# Altium project IBB.PrjPcb (part 3 of 11)
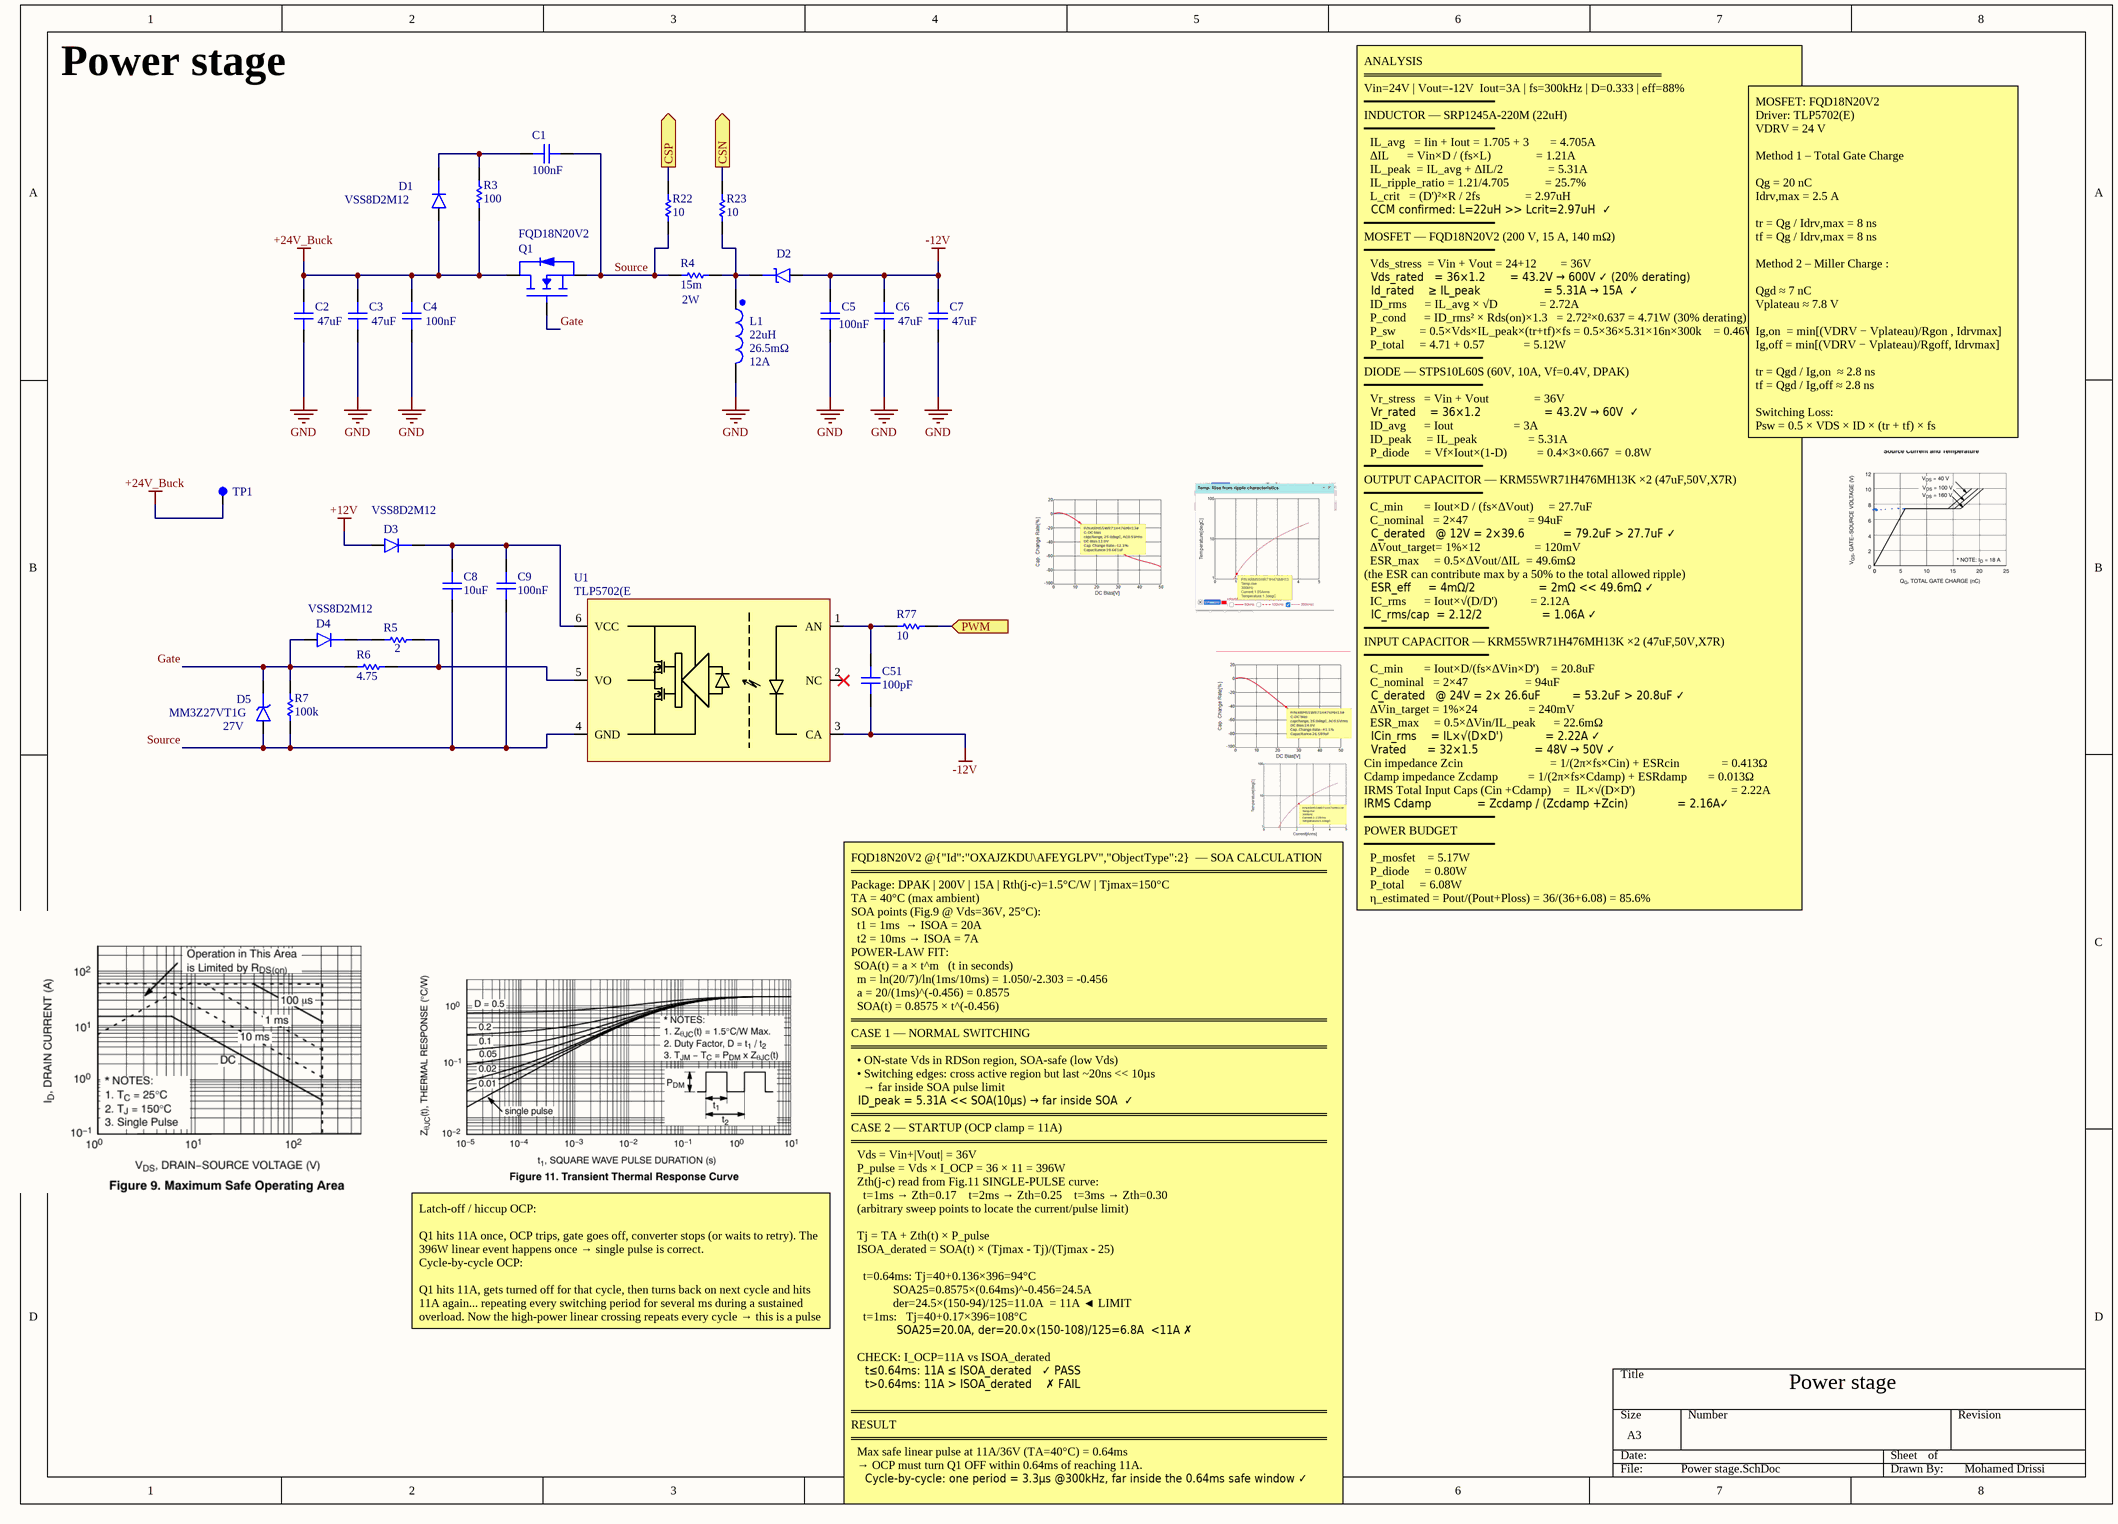
[diagram p9: Power stage.SchDoc]

## Sheet Power stage.SchDoc (continued)

### Library data of the parts (continued)
R22 R23 = Yageo RC0603FR-0710RL: Res Thick Film 0603 1K Ohm 1% 0.1W(1/10W) ±100ppm/°C Pad SMD T/R / RES SMD 1K OHM 1% 1/10W 0603; Manufacturer: Yageo Group; Manufacturer Part Number: RC0603FR-071KL; Power Rating: 100mW; Value: 1kΩ; Voltage Rating: 50V; Working Voltage: 75V; Supplier: DigiKey; Supplier Part Number: 311-1.00KHRDKR-ND; RoHS: Compliant; Category: Chip SMD Resistors; Stock: 2879129; Pricing: 1=0,1, 10=0,025, 25=0,0188, 50=0,015, 100=0,0122, 250=0,0094, 500=0,00782, 1000=0,00661 (USD); Case/Package: 0603; Case Code (Imperial): 0603; Case Code (Metric): 0603; China RoHS: Non-Compliant; Composition: Thick Film; Contact Plating: Tin; Country of Origin: Mainland China, Taiwan; Depth: 800µm; Export Control Classification Number (ECCN) Code: EAR99; Height: 450µm; Harmonized Tariff Schedule (HTS) Code: 8533.21.00.30; Introduction Date: 2004-10-04; Lead Free: Lead Free; Length: 1.6mm; Lifecycle Status: Production; Max Operating Temperature: 155°C; Military Standard: Not; Min Operating Temperature: -55°C; Mounting Technology: Surface Mount; Pins: 2; Number of Terminals: 2; Packaging: Tape and Reel; Radiation Hardening: No; REACH SVHC: Yes; Schedule B: 8533210045, 8533210045|8533210045|8533210045|8533210045|8533210045|8533210045|8533210045|8533210045|8533210045|8533210045|8533210045|8533210045|8533210045|8533210045|8533210045|8533210045|8533210045|8533210045|8533210045|8533210045|8533210045|8533210045|8533210045|85; Temperature Coefficient: 100ppm/°C; Termination: SMD/SMT; Tolerance: 1%; Voltage Rating (DC): 50V; Width: 800µm; ComponentLink1URL: https://datasheet.octopart.com:443/RC0603FR-071KL-Yageo-datasheet-175887523.pdf?src-supplier=Newark; ComponentLink1Description: https://datasheet.octopart.com:443/RC0603FR-071KL-Yageo-datasheet-175887523.pdf?src-supplier=Newark; ComponentLink2URL: https://datasheet.octopart.com:443/RC0603FR-071KL-Yageo-datasheet-34211833.pdf?src-supplier=Newark; ComponentLink2Description: https://datasheet.octopart.com:443/RC0603FR-071KL-Yageo-datasheet-34211833.pdf?src-supplier=Newark; ComponentLink3URL: https://datasheet.octopart.com:443/RC0603FR-071KL-Yageo-datasheet-12596169.pdf?src-supplier=Newark; ComponentLink3Description: https://datasheet.octopart.com:443/RC0603FR-071KL-Yageo-datasheet-12596169.pdf?src-supplier=Newark; ComponentLink4URL: https://datasheet.octopart.com:443/RC0603FR-071KL-Yageo-datasheet-499455.pdf?src-supplier=Newark; ComponentLink4Description: https://datasheet.octopart.com:443/RC0603FR-071KL-Yageo-datasheet-499455.pdf?src-supplier=Newark; ComponentLink5URL: https://datasheet.octopart.com:443/RC0603FR-071KL-Yageo-datasheet-503470.pdf?src-supplier=Newark; ComponentLink5Description: https://datasheet.octopart.com:443/RC0603FR-071KL-Yageo-datasheet-503470.pdf?src-supplier=Newark; ComponentLink6URL: https://datasheet.octopart.com:443/RC0603FR-071KL-Yageo-datasheet-62067350.pdf?src-supplier=element14+APAC; ComponentLink6Description: https://datasheet.octopart.com:443/RC0603FR-071KL-Yageo-datasheet-62067350.pdf?src-supplier=element14+APAC; ComponentLink7URL: https://datasheet.octopart.com:443/RC0603FR-071KL-Yageo-datasheet-21426514.pdf?src-supplier=element14+APAC; ComponentLink7Description: https://datasheet.octopart.com:443/RC0603FR-071KL-Yageo-datasheet-21426514.pdf?src-supplier=element14+APAC; ComponentLink8URL: https://datasheet.octopart.com:443/RC0603FR-071KL-Yageo-datasheet-141265859.pdf?src-supplier=Upverter; ComponentLink8Description: https://datasheet.octopart.com:443/RC0603FR-071KL-Yageo-datasheet-141265859.pdf?src-supplier=Upverter; ComponentLink9URL: https://datasheet.octopart.com:443/RC0603FR-071KL-Yageo-datasheet-103092701.pdf?src-supplier=Upverter; ComponentLink9Description: https://datasheet.octopart.com:443/RC0603FR-071KL-Yageo-datasheet-103092701.pdf?src-supplier=Upverter; ComponentLink10URL: https://sigma.octopart.com:443/138820526/technical_drawing/Yageo-RC0603FR-071KL.pdf?src-supplier=Upverter; ComponentLink10Description: https://sigma.octopart.com:443/138820526/technical_drawing/Yageo-RC0603FR-071KL.pdf?src-supplier=Upverter; ComponentLink11URL: https://datasheet.octopart.com:443/RC0603FR-071KL-Yageo-datasheet-68297981.pdf?src-supplier=Upverter; ComponentLink11Description: https://datasheet.octopart.com:443/RC0603FR-071KL-Yageo-datasheet-68297981.pdf?src-supplier=Upverter; ComponentLink12URL: https://datasheet.octopart.com:443/RC0603FR-071KL-Yageo-datasheet-8328172.pdf?src-supplier=Farnell; ComponentLink12Description: https://datasheet.octopart.com:443/RC0603FR-071KL-Yageo-datasheet-8328172.pdf?src-supplier=Farnell; ComponentLink13URL: https://datasheet.octopart.com:443/RC0603FR-071KL-Yageo-datasheet-13691069.pdf?src-supplier=Farnell; ComponentLink13Description: https://datasheet.octopart.com:443/RC0603FR-071KL-Yageo-datasheet-13691069.pdf?src-supplier=Farnell; ComponentLink14URL: https://datasheet.octopart.com:443/RC0603FR-071KL-Yageo-datasheet-15599030.pdf?src-supplier=Seeed+Studio; ComponentLink14Description: https://datasheet.octopart.com:443/RC0603FR-071KL-Yageo-datasheet-15599030.pdf?src-supplier=Seeed+Studio; ComponentLink15URL: https://datasheet.octopart.com:443/RC0603FR-071KL-Yageo-Group-datasheet-176638170.pdf?src-supplier=Future+Electronics; ComponentLink15Description: https://datasheet.octopart.com:443/RC0603FR-071KL-Yageo-Group-datasheet-176638170.pdf?src-supplier=Future+Electronics; ComponentLink16URL: https://datasheet.octopart.com:443/RC0603FR-071KL-Yageo-datasheet-164759695.pdf?src-supplier=Future+Electronics; ComponentLink16Description: https://datasheet.octopart.com:443/RC0603FR-071KL-Yageo-datasheet-164759695.pdf?src-supplier=Future+Electronics; ComponentLink17URL: https://datasheet.octopart.com:443/RC0603FR-071KL-Yageo-datasheet-137700087.pdf?src-supplier=Future+Electronics; ComponentLink17Description: https://datasheet.octopart.com:443/RC0603FR-071KL-Yageo-datasheet-137700087.pdf?src-supplier=Future+Electronics; ComponentLink18URL: https://datasheet.octopart.com:443/RC0603FR071KL-Yageo-datasheet-27584510.pdf?src-supplier=Future+Electronics; ComponentLink18Description: https://datasheet.octopart.com:443/RC0603FR071KL-Yageo-datasheet-27584510.pdf?src-supplier=Future+Electronics; ComponentLink19URL: https://datasheet.octopart.com:443/RC0603FR-071KL-Yageo-datasheet-8324193.pdf?src-supplier=Future+Electronics; ComponentLink19Description: https://datasheet.octopart.com:443/RC0603FR-071KL-Yageo-datasheet-8324193.pdf?src-supplier=Future+Electronics; ComponentLink20URL: https://datasheet.octopart.com:443/RC0603FR-071KL-Yageo-datasheet-79472498.pdf?src-supplier=Megastar; ComponentLink20Description: https://datasheet.octopart.com:443/RC0603FR-071KL-Yageo-datasheet-79472498.pdf?src-supplier=Megastar; ComponentLink21URL: https://datasheet.octopart.com/RC0603FR-071KL-Yageo-datasheet-73766026.pdf; ComponentLink21Description: https://datasheet.octopart.com/RC0603FR-071KL-Yageo-datasheet-73766026.pdf; ComponentLink22URL: https://datasheet.octopart.com:443/RC0603FR-071KL-Yageo-datasheet-118562.pdf?src-supplier=DigiKey; ComponentLink22Description: https://datasheet.octopart.com:443/RC0603FR-071KL-Yageo-datasheet-118562.pdf?src-supplier=DigiKey; ComponentLink23URL: http://sigma.octopart.com:80/conflict_mineral_statement/Yageo-company-3.pdf?src-supplier=Compliance+Statements; ComponentLink23Description: http://sigma.octopart.com:80/conflict_mineral_statement/Yageo-company-3.pdf?src-supplier=Compliance+Statements; ComponentLink24URL: http://sigma.octopart.com:80/rohs_statement/Yageo-company-2.pdf?src-supplier=Compliance+Statements; ComponentLink24Description: http://sigma.octopart.com:80/rohs_statement/Yageo-company-2.pdf?src-supplier=Compliance+Statements
R77 = Yageo RT0603BRE0710RL: Fixed Resistor, Thin Film, 0.1W, 10ohm, 75V, 0.1% +/-Tol, 50ppm/Cel, Surface Mount, 0603; Manufacturer: Yageo Group; Max Power Dissipation: 100mW; Temperature Coefficient: 50ppm/°C; Voltage Rating (DC): 50V; Supplier: DigiKey; Supplier Part Number: 13-RT0603BRE0710RLDKR-ND; Manufacturer Part Number: RT0603BRE0710RL; RoHS: Compliant; Category: Chip SMD Resistors; Stock: 24199; Pricing: 1=0,19, 10=0,163, 25=0,1512, 50=0,1428, 100=0,1349, 250=0,12532, 500=0,11876, 1000=0,11281 (USD); Case/Package: 0603; Case Code (Metric): 0603; China RoHS: Non-Compliant; Composition: Thin Film; Height: 450µm; Lead Free: Lead Free; Length: 1.6mm; Lifecycle Status: Production; Max Operating Temperature: 155°C; Min Operating Temperature: -55°C; Mounting Technology: Surface Mount; Number of Terminals: 2; Number of Terminations: 2; Packaging: Tape & Reel (TR); Power Rating: 100mW; REACH SVHC: Yes; Tolerance: 0.1%; Voltage Rating: 75V; Width: 800µm; Working Voltage: 75V; ComponentLink1URL: https://datasheet.octopart.com:443/RT0603BRE0710RL-Yageo-datasheet-176402239.pdf?src-supplier=Future+Electronics; ComponentLink1Description: https://datasheet.octopart.com:443/RT0603BRE0710RL-Yageo-datasheet-176402239.pdf?src-supplier=Future+Electronics; ComponentLink2URL: https://datasheet.octopart.com:443/RT0603BRE0710RL-Yageo-datasheet-169971040.pdf?src-supplier=Future+Electronics; ComponentLink2Description: https://datasheet.octopart.com:443/RT0603BRE0710RL-Yageo-datasheet-169971040.pdf?src-supplier=Future+Electronics; ComponentLink3URL: https://datasheet.octopart.com:443/RT0603BRE0710RL-Yageo-datasheet-96443642.pdf?src-supplier=Upverter; ComponentLink3Description: https://datasheet.octopart.com:443/RT0603BRE0710RL-Yageo-datasheet-96443642.pdf?src-supplier=Upverter; ComponentLink4URL: https://datasheet.octopart.com/RT0603BRE0710RL-Yageo-datasheet-86813807.pdf; ComponentLink4Description: https://datasheet.octopart.com/RT0603BRE0710RL-Yageo-datasheet-86813807.pdf; ComponentLink5URL: http://sigma.octopart.com:80/conflict_mineral_statement/Yageo-company-3.pdf?src-supplier=Compliance+Statements; ComponentLink5Description: http://sigma.octopart.com:80/conflict_mineral_statement/Yageo-company-3.pdf?src-supplier=Compliance+Statements; ComponentLink6URL: http://sigma.octopart.com:80/rohs_statement/Yageo-company-2.pdf?src-supplier=Compliance+Statements; ComponentLink6Description: http://sigma.octopart.com:80/rohs_statement/Yageo-company-2.pdf?src-supplier=Compliance+Statements
TP1 = Keystone 5000: Cable Wrap, 1/2 Inch, Polyethylene, Natural, 50 Ft, Spirap Series | TE Connectivity 500002-1; Body Material: Bronze, PBT; Hole Diameter: 1.6mm; Inside Diameter: 1.27mm; Insulation: Insulated; Number of Contacts: 1; Outside Diameter: 2.54mm; Plating: Silver; Supplier: Future Electronics; Supplier Part Number: 5000; Manufacturer: Keystone; Manufacturer Part Number: 5000; RoHS: Compliant; Category: Test Points; Stock: 278803; Pricing: 200=0,0998, 500=0,0974, 1500=0,0947, 3000=0,093, 10000=0,088 (USD); Color: Red; Contact Material: Silver; Contact Plating: Silver; Flammability Rating: UL94 V-0; Height: 4.72mm; Housing Color: Red; Lead Free: Lead Free; Length: 7.62mm; Lifecycle Status: Production; Material: Bronze, Nylon, Silver; Mounting Technology: PCB, Through Hole; Number of Ports: 1; Orientation: Straight; Packaging: Bulk; REACH SVHC: Yes; ComponentLink1URL: https://datasheet.octopart.com:443/5000-Keystone-datasheet-138896739.pdf?src-supplier=Upverter; ComponentLink1Description: https://datasheet.octopart.com:443/5000-Keystone-datasheet-138896739.pdf?src-supplier=Upverter; ComponentLink2URL: https://datasheet.octopart.com:443/5000-Keystone-datasheet-15716159.pdf?src-supplier=IHS; ComponentLink2Description: https://datasheet.octopart.com:443/5000-Keystone-datasheet-15716159.pdf?src-supplier=IHS; ComponentLink3URL: https://datasheet.octopart.com:443/5000-Keystone-datasheet-9590016.pdf?src-supplier=Sager+Electronics; ComponentLink3Description: https://datasheet.octopart.com:443/5000-Keystone-datasheet-9590016.pdf?src-supplier=Sager+Electronics; ComponentLink4URL: https://datasheet.octopart.com:443/5000-Keystone-datasheet-23674.pdf?src-supplier=SOS+electronic; ComponentLink4Description: https://datasheet.octopart.com:443/5000-Keystone-datasheet-23674.pdf?src-supplier=SOS+electronic; ComponentLink5URL: https://datasheet.octopart.com:443/5000-Keystone-datasheet-549598.pdf?src-supplier=Farnell; ComponentLink5Description: https://datasheet.octopart.com:443/5000-Keystone-datasheet-549598.pdf?src-supplier=Farnell; ComponentLink6URL: https://datasheet.octopart.com:443/5000-Keystone-datasheet-60278094.pdf?src-supplier=Future+Electronics; ComponentLink6Description: https://datasheet.octopart.com:443/5000-Keystone-datasheet-60278094.pdf?src-supplier=Future+Electronics; ComponentLink7URL: https://datasheet.octopart.com:443/5000-Keystone-datasheet-542585.pdf?src-supplier=Future+Electronics; ComponentLink7Description: https://datasheet.octopart.com:443/5000-Keystone-datasheet-542585.pdf?src-supplier=Future+Electronics; ComponentLink8URL: https://datasheet.octopart.com:443/5000-Keystone-datasheet-10925273.pdf?src-supplier=Factory+Futures; ComponentLink8Description: https://datasheet.octopart.com:443/5000-Keystone-datasheet-10925273.pdf?src-supplier=Factory+Futures; ComponentLink9URL: https://datasheet.octopart.com:443/5000-Keystone-datasheet-15983577.pdf?src-supplier=element14+APAC; ComponentLink9Description: https://datasheet.octopart.com:443/5000-Keystone-datasheet-15983577.pdf?src-supplier=element14+APAC; ComponentLink10URL: https://datasheet.octopart.com:443/5000-Keystone-datasheet-6528.pdf?src-supplier=RS+(Formerly+Allied+Electronics); ComponentLink10Description: https://datasheet.octopart.com:443/5000-Keystone-datasheet-6528.pdf?src-supplier=RS+(Formerly+Allied+Electronics)
U1 = Toshiba TLP5702(E: Optocoupler DC-IN Single Totem-Pole-OUT 6-Pin SOIC Magazine; Forward Current: 10mA; Isolation Voltage: 5000Vrms; Min Supply Voltage: 15V; Number of Circuits: 1; Propagation Delay: 200ns; Response Time: 15ns; Supplier: DigiKey; Supplier Part Number: TLP5702(E-ND; Manufacturer: Toshiba; Manufacturer Part Number: TLP5702(E; RoHS: Compliant; Category: Digital Isolators; Stock: 95; Pricing: 1=1,44, 10=1,018, 125=0,74496, 500=0,65032, 1000=0,61339, 2000=0,58209, 5000=0,54792, 10000=0,52666 (USD); Case/Package: SO; Lifecycle Status: Production; Max Operating Temperature: 100°C; Min Operating Temperature: -40°C; Mounting Technology: Surface Mount; Number of Elements: 1; Packaging: Bulk; Radiation Hardening: No; Schedule B: 8541408000; ComponentLink1URL: https://datasheet.octopart.com:443/TLP5702%28E-Toshiba-datasheet-181397918.pdf?src-supplier=IHS; ComponentLink1Description: https://datasheet.octopart.com:443/TLP5702%28E-Toshiba-datasheet-181397918.pdf?src-supplier=IHS

## Sheet current sense.SchDoc
size A4; SheetNumber: 4; SheetTotal: 8
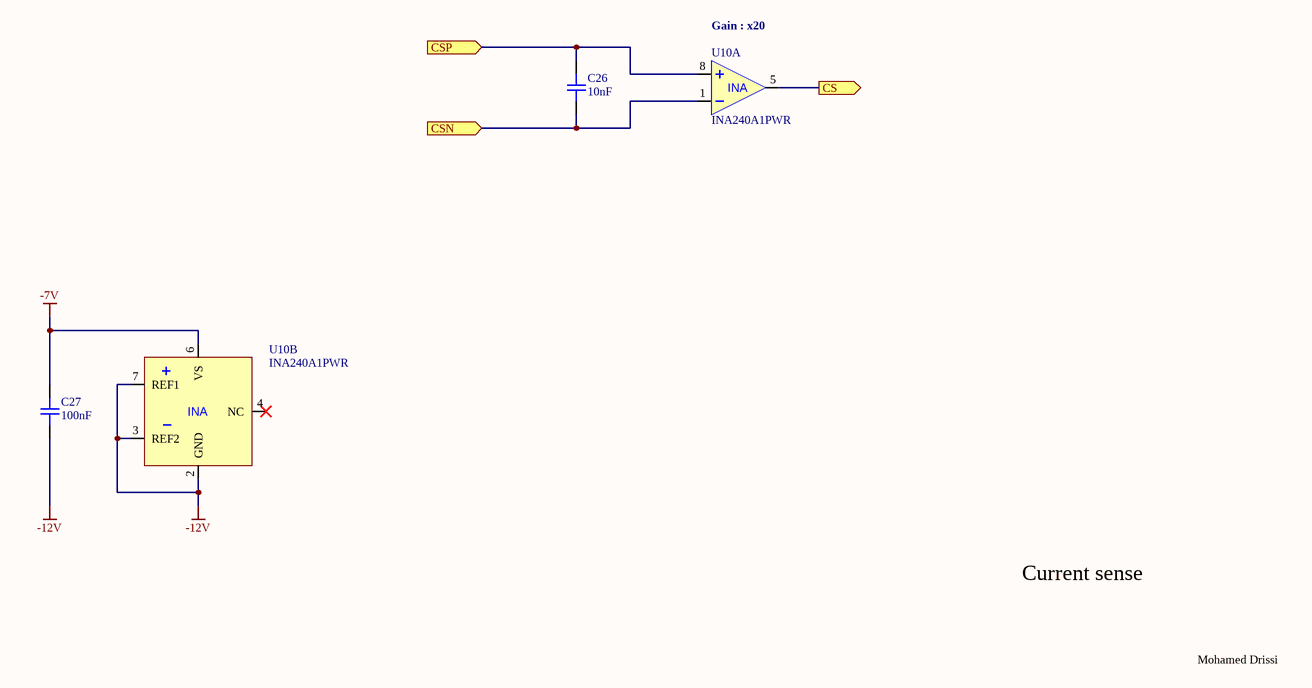
[diagram p2: current sense.SchDoc]

### Parts
C26  Capacitance: 10nF  [cap_0603]  (hidden comment: C0603C103K4RACTU)
C27  Capacitance: 100nF  [cap_0603]  (hidden comment: GMC10X7R104K100NT)
U10  INA240A1PWR  [SOIC]  (parts A,B of 2)

### Ports
CS (out, see Main[3C], Control circuit[2B], Protections[4A]), CSN (in, see Main[3B], Power stage[3A]), CSP (in, see Main[3B], Power stage[2A])

### Nets
-7V: C27.2 U10.6(VS)
-12V: C27.1 U10.2(GND) U10.3(REF2) U10.7(REF1)
NetC26_1: C26.1 U10.1(IN-) ; port CSN
NetC26_2: C26.2 U10.8(IN+) ; port CSP
NetU6_1: U10.5(OUT) ; port CS

Not connected (* = marked no-connect by the designer): U10 4(NC)*

### Notes on the sheet
- (near U10) Gain : x20
- Current sense
- Mohamed Drissi
- (in symbol TI INA240A1PWR, part A) INA
- (in symbol TI INA240A1PWR, part B) INA

### Library data of the parts
C26 = Yageo C0603C103K4RACTU: Multilayer Ceramic Capacitors MLCC - SMD/SMT 16V 0.01uF X7R 0603 10%; Manufacturer: Yageo Group; Dissipation Factor: 3.5%; Temperature Coefficient: 30ppm/°C; Supplier: Farnell; Supplier Part Number: C0603C103K4RACTU; Manufacturer Part Number: C0603C103K4RACTU; RoHS: Compliant; Category: Ceramic Capacitors; Stock: 16775; Pricing: 10=0,0275, 100=0,0212, 500=0,0177, 1000=0,0142, 2000=0,0133 (GBP); Case/Package: 0603; Case Code (Imperial): 0603; Case Code (Metric): 1608; China RoHS: Compliant; Country of Origin: Mexico; Depth: 800µm; Dielectric: X7R; Dielectric Material: Ceramic; Export Control Classification Number (ECCN) Code: EAR99; Height: 800µm; Harmonized Tariff Schedule (HTS) Code: 8532.24.00.20; Introduction Date: 2008-01-10; Lead Pitch: 700µm; Length: 1.6mm; Lifecycle Status: Production; Material: Ceramic; Max Operating Temperature: 125°C; Min Operating Temperature: -55°C; Mounting Technology: Surface Mount; Pins: 2; Number of Terminals: 2; Packaging: Cut Tape; Radiation Hardening: No; REACH SVHC: Yes; Schedule B: 8532240020, 8532240020|8532240020, 8532240020|8532240020|8532240020, 8532240020|8532240020|8532240020|8532240020; Termination: SMD/SMT; Thickness: 863.6µm; Tolerance: 10%; Voltage Rating: 16V; Voltage Rating (DC): 16V; Width: 800µm; ComponentLink1URL: https://datasheet.octopart.com:443/C0603C103K4RACTU-KEMET-datasheet-178445679.pdf?src-supplier=IHS; ComponentLink1Description: https://datasheet.octopart.com:443/C0603C103K4RACTU-KEMET-datasheet-178445679.pdf?src-supplier=IHS; ComponentLink2URL: https://datasheet.octopart.com:443/C0603C103K4RAC7867-KEMET-datasheet-184792798.pdf?src-supplier=IHS; ComponentLink2Description: https://datasheet.octopart.com:443/C0603C103K4RAC7867-KEMET-datasheet-184792798.pdf?src-supplier=IHS; ComponentLink3URL: https://datasheet.octopart.com:443/C0603C103K4RACTU-KEMET-datasheet-137357759.pdf?src-supplier=Farnell; ComponentLink3Description: https://datasheet.octopart.com:443/C0603C103K4RACTU-KEMET-datasheet-137357759.pdf?src-supplier=Farnell; ComponentLink4URL: https://datasheet.octopart.com:443/C0603C103K4RACTU-Kemet-datasheet-5313890.pdf?src-supplier=Farnell; ComponentLink4Description: https://datasheet.octopart.com:443/C0603C103K4RACTU-Kemet-datasheet-5313890.pdf?src-supplier=Farnell; ComponentLink5URL: https://datasheet.octopart.com:443/C0603C103K4RACTU-Kemet-datasheet-12608295.pdf?src-supplier=Farnell; ComponentLink5Description: https://datasheet.octopart.com:443/C0603C103K4RACTU-Kemet-datasheet-12608295.pdf?src-supplier=Farnell; ComponentLink6URL: https://datasheet.octopart.com:443/C0603C103K4RACTU-Kemet-datasheet-11992184.pdf?src-supplier=Farnell; ComponentLink6Description: https://datasheet.octopart.com:443/C0603C103K4RACTU-Kemet-datasheet-11992184.pdf?src-supplier=Farnell; ComponentLink7URL: https://datasheet.octopart.com:443/C0603C103K4RACTU-Kemet-datasheet-10942409.pdf?src-supplier=Farnell; ComponentLink7Description: https://datasheet.octopart.com:443/C0603C103K4RACTU-Kemet-datasheet-10942409.pdf?src-supplier=Farnell; ComponentLink8URL: https://datasheet.octopart.com:443/C0603C103K4RACTU-Kemet-datasheet-10404442.pdf?src-supplier=Farnell; ComponentLink8Description: https://datasheet.octopart.com:443/C0603C103K4RACTU-Kemet-datasheet-10404442.pdf?src-supplier=Farnell; ComponentLink9URL: https://datasheet.octopart.com:443/C0603C103K4RACTU-Kemet-datasheet-8764837.pdf?src-supplier=Farnell; ComponentLink9Description: https://datasheet.octopart.com:443/C0603C103K4RACTU-Kemet-datasheet-8764837.pdf?src-supplier=Farnell; ComponentLink10URL: https://datasheet.octopart.com:443/C0603C103K4RACTU-Kemet-datasheet-8480123.pdf?src-supplier=Farnell; ComponentLink10Description: https://datasheet.octopart.com:443/C0603C103K4RACTU-Kemet-datasheet-8480123.pdf?src-supplier=Farnell; ComponentLink11URL: https://datasheet.octopart.com:443/C0603C103K4RACTU-Kemet-datasheet-5390537.pdf?src-supplier=Farnell; ComponentLink11Description: https://datasheet.octopart.com:443/C0603C103K4RACTU-Kemet-datasheet-5390537.pdf?src-supplier=Farnell; ComponentLink12URL: https://datasheet.octopart.com:443/C0603C103K4RACTU-Kemet-datasheet-5393970.pdf?src-supplier=Farnell; ComponentLink12Description: https://datasheet.octopart.com:443/C0603C103K4RACTU-Kemet-datasheet-5393970.pdf?src-supplier=Farnell; ComponentLink13URL: https://datasheet.octopart.com:443/C0603C103K4RACTU-Kemet-datasheet-8502025.pdf?src-supplier=Farnell; ComponentLink13Description: https://datasheet.octopart.com:443/C0603C103K4RACTU-Kemet-datasheet-8502025.pdf?src-supplier=Farnell; ComponentLink14URL: https://datasheet.octopart.com:443/C0603C103K4RACTU-Kemet-datasheet-7541751.pdf?src-supplier=Farnell; ComponentLink14Description: https://datasheet.octopart.com:443/C0603C103K4RACTU-Kemet-datasheet-7541751.pdf?src-supplier=Farnell; ComponentLink15URL: https://datasheet.octopart.com:443/C0603C103K4RACTU-Kemet-datasheet-161801.pdf?src-supplier=Farnell; ComponentLink15Description: https://datasheet.octopart.com:443/C0603C103K4RACTU-Kemet-datasheet-161801.pdf?src-supplier=Farnell; ComponentLink16URL: https://datasheet.octopart.com:443/C0603C103K4RACTU-KEMET-datasheet-101575644.pdf?src-supplier=Farnell; ComponentLink16Description: https://datasheet.octopart.com:443/C0603C103K4RACTU-KEMET-datasheet-101575644.pdf?src-supplier=Farnell; ComponentLink17URL: https://datasheet.octopart.com:443/C0603C103K4RACTU.-Kemet-datasheet-41232427.pdf?src-supplier=Farnell; ComponentLink17Description: https://datasheet.octopart.com:443/C0603C103K4RACTU.-Kemet-datasheet-41232427.pdf?src-supplier=Farnell; ComponentLink18URL: https://datasheet.octopart.com:443/C0603C103K4RACTU-Kemet-datasheet-24570007.pdf?src-supplier=Farnell; ComponentLink18Description: https://datasheet.octopart.com:443/C0603C103K4RACTU-Kemet-datasheet-24570007.pdf?src-supplier=Farnell; ComponentLink19URL: https://datasheet.octopart.com:443/C0603C103K4RACTU-Kemet-datasheet-22084244.pdf?src-supplier=Farnell; ComponentLink19Description: https://datasheet.octopart.com:443/C0603C103K4RACTU-Kemet-datasheet-22084244.pdf?src-supplier=Farnell; ComponentLink20URL: https://datasheet.octopart.com:443/C0603C103K4RACTU-KEMET-datasheet-137357764.pdf?src-supplier=Upverter; ComponentLink20Description: https://datasheet.octopart.com:443/C0603C103K4RACTU-KEMET-datasheet-137357764.pdf?src-supplier=Upverter; ComponentLink21URL: https://datasheet.octopart.com:443/C0603C103K4RACTU-KEMET-datasheet-149521824.pdf?src-supplier=Newark; ComponentLink21Description: https://datasheet.octopart.com:443/C0603C103K4RACTU-KEMET-datasheet-149521824.pdf?src-supplier=Newark; ComponentLink22URL: https://datasheet.octopart.com:443/C0603C103K4RACTU-KEMET-datasheet-176289389.pdf?src-supplier=Newark; ComponentLink22Description: https://datasheet.octopart.com:443/C0603C103K4RACTU-KEMET-datasheet-176289389.pdf?src-supplier=Newark; ComponentLink23URL: https://datasheet.octopart.com:443/C0603C103K4RACTU-KEMET-datasheet-130256537.pdf?src-supplier=Newark; ComponentLink23Description: https://datasheet.octopart.com:443/C0603C103K4RACTU-KEMET-datasheet-130256537.pdf?src-supplier=Newark; ComponentLink24URL: https://datasheet.octopart.com:443/C0603C103K4RACTU-KEMET-datasheet-157246124.pdf?src-supplier=Electro+Sonic; ComponentLink24Description: https://datasheet.octopart.com:443/C0603C103K4RACTU-KEMET-datasheet-157246124.pdf?src-supplier=Electro+Sonic; ComponentLink25URL: https://datasheet.octopart.com:443/C0603C103K4RACTU-KEMET-datasheet-32036385.pdf?src-supplier=Electro+Sonic; ComponentLink25Description: https://datasheet.octopart.com:443/C0603C103K4RACTU-KEMET-datasheet-32036385.pdf?src-supplier=Electro+Sonic; ComponentLink26URL: https://datasheet.octopart.com:443/C0603C103K4RACTU-KEMET-datasheet-164512540.pdf?src-supplier=TME; ComponentLink26Description: https://datasheet.octopart.com:443/C0603C103K4RACTU-KEMET-datasheet-164512540.pdf?src-supplier=TME; ComponentLink27URL: https://datasheet.octopart.com:443/C0603C103K4RACTU-KEMET-datasheet-68321734.pdf?src-supplier=TME; ComponentLink27Description: https://datasheet.octopart.com:443/C0603C103K4RACTU-KEMET-datasheet-68321734.pdf?src-supplier=TME; ComponentLink28URL: https://datasheet.octopart.com:443/C0603C103K4RACTU-KEMET-datasheet-68331906.pdf?src-supplier=TME; ComponentLink28Description: https://datasheet.octopart.com:443/C0603C103K4RACTU-KEMET-datasheet-68331906.pdf?src-supplier=TME; ComponentLink29URL: https://datasheet.octopart.com:443/C0603C103K4RACTU-KEMET-datasheet-110724412.pdf?src-supplier=RS+(Formerly+Allied+Electronics); ComponentLink29Description: https://datasheet.octopart.com:443/C0603C103K4RACTU-KEMET-datasheet-110724412.pdf?src-supplier=RS+(Formerly+Allied+Electronics); ComponentLink30URL: https://datasheet.octopart.com:443/C0603C103K4RACTU-Kemet-datasheet-60243841.pdf?src-supplier=RS+(Formerly+Allied+Electronics); ComponentLink30Description: https://datasheet.octopart.com:443/C0603C103K4RACTU-Kemet-datasheet-60243841.pdf?src-supplier=RS+(Formerly+Allied+Electronics); ComponentLink31URL: https://datasheet.octopart.com/C0603C103K4RACTU-KEMET-datasheet-84169754.pdf; ComponentLink31Description: https://datasheet.octopart.com/C0603C103K4RACTU-KEMET-datasheet-84169754.pdf; ComponentLink32URL: https://datasheet.octopart.com:443/C0603C103K4RAC-TU-Kemet-datasheet-7838125.pdf?src-supplier=Jameco; ComponentLink32Description: https://datasheet.octopart.com:443/C0603C103K4RAC-TU-Kemet-datasheet-7838125.pdf?src-supplier=Jameco; ComponentLink33URL: http://sigma.octopart.com:80/conflict_mineral_statement/Yageo-company-3.pdf?src-supplier=Compliance+Statements; ComponentLink33Description: http://sigma.octopart.com:80/conflict_mineral_statement/Yageo-company-3.pdf?src-supplier=Compliance+Statements; ComponentLink34URL: http://sigma.octopart.com:80/rohs_statement/Yageo-company-2.pdf?src-supplier=Compliance+Statements; ComponentLink34Description: http://sigma.octopart.com:80/rohs_statement/Yageo-company-2.pdf?src-supplier=Compliance+Statements
C27 = Cal-chip GMC10X7R104K100NT: 100V 100nF X7R ±10% 0603 Multilayer Ceramic Capacitors MLCC - SMD/SMT ROHS; Manufacturer: Cal-Chip Electronics; Supplier: DigiKey; Supplier Part Number: 4713-GMC10X7R104K100NTCT-ND; Manufacturer Part Number: GMC10X7R104K100NT; RoHS: Compliant; Category: Ceramic Capacitors; Stock: 34767; Pricing: 1=0,1, 10=0,045, 50=0,0306, 100=0,0262, 500=0,01902, 1000=0,0168 (USD); Case/Package: 0603; China RoHS: Compliant; Dielectric Material: Ceramic; Height: 950µm; Length: 1.6mm; Lifecycle Status: Production; Max Operating Temperature: 125°C; Min Operating Temperature: -55°C; Mounting Technology: Surface Mount; Number of Terminals: 2; REACH SVHC: Yes; Voltage Rating (DC): 100V; Width: 800µm; ComponentLink1URL: https://datasheet.octopart.com:443/GMC10X7R104K100NT-Cal-Chip-Electronics-datasheet-182028815.pdf?src-supplier=IHS; ComponentLink1Description: https://datasheet.octopart.com:443/GMC10X7R104K100NT-Cal-Chip-Electronics-datasheet-182028815.pdf?src-supplier=IHS
U10 = TI INA240A1PWR: Op Amp Single Zero Drift Amplifier 5.5V 8-Pin TSSOP T/R; Manufacturer: Texas Instruments; Manufacturer Lifecycle Status: ACTIVE; Bandwidth: 400kHz; Input Bias Current: 90µA; Input Offset Voltage (Vos): 5µV; Max Junction Temperature (Tj): 150°C; Min Supply Voltage: 2.7V; Nominal Supply Current: 1.8mA; Number of Channels: 1; Supplier: Arrow Electronics; Supplier Part Number: INA240A1PWR; Manufacturer Part Number: INA240A1PWR; RoHS: Compliant; Category: Amplifiers - Op Amps, Buffer, Instrumentation; Stock: 449; Pricing: 1=3,1221, 10=2,403, 25=2,2062, 100=1,9491, 250=1,84 (USD); Ambient Temperature Range High: 125°C; Case/Package: TSSOP; Height: 1.2mm; Lead Free: Lead Free; Length: 3mm; Lifecycle Status: Production; Max Operating Temperature: 125°C; Max Supply Voltage: 5.5V; Min Operating Temperature: -40°C; Pins: 8; Packaging: Cut Tape; Schedule B: 8542390000, 8542390000|8542390000|8542390000|8542390000|8542390000; Thickness: 1mm; Width: 4.4mm; ComponentLink1URL: https://octopart.com:443/opatz8j6/c1?t=6b5ds5zphu4iqUhGNAPiVHzmQf_HL7e1E5UT2beWP4N2AUke_jOvonAQg0R4M0fKF8_rOW3PQdhUTq9RbFr9x0koj0vt9WEXvQIr2Xb8W6mrYAbRTeGV92QdBvy7W47PufrnRYDulXaXNo6SzTOmflcuzpg__6qv2Cnz6zhuL4qfO7rFJ3GiUIC-sSgXLYJxZFQl6eX-9KFvOiRir4o1IB0ufZchFYOXq5pnhEqDmivBzqZyEXrKsef3SNQzWVhfEPUQ_HYUNfeqlLpMriLHn-U6iJiVIypTpS419iyJOhV020lbUEaR7jMQnHtQpCB4MuonRBeDH0zcF8XPK3nYA9RAaNVtgVJQ_IBr8E6FLEFkoip-xrFWLKqSqo7VXkO8ZHfHXQ&src-supplier=Texas+Instruments; ComponentLink1Description: https://octopart.com:443/opatz8j6/c1?t=6b5ds5zphu4iqUhGNAPiVHzmQf_HL7e1E5UT2beWP4N2AUke_jOvonAQg0R4M0fKF8_rOW3PQdhUTq9RbFr9x0koj0vt9WEXvQIr2Xb8W6mrYAbRTeGV92QdBvy7W47PufrnRYDulXaXNo6SzTOmflcuzpg__6qv2Cnz6zhuL4qfO7rFJ3GiUIC-sSgXLYJxZFQl6eX-9KFvOiRir4o1IB0ufZchFYOXq5pnhEqDmivBzqZyEXrKsef3SNQzWVhfEPUQ_HYUNfeqlLpMriLHn-U6iJiVIypTpS419iyJOhV020lbUEaR7jMQnHtQpCB4MuonRBeDH0zcF8XPK3nYA9RAaNVtgVJQ_IBr8E6FLEFkoip-xrFWLKqSqo7VXkO8ZHfHXQ&src-supplier=Texas+Instruments; ComponentLink2URL: https://sigma.octopart.com:443/49250270/technical_drawing/Texas-Instruments-INA240A1PWR.pdf?src-supplier=Texas+Instruments; ComponentLink2Description: https://sigma.octopart.com:443/49250270/technical_drawing/Texas-Instruments-INA240A1PWR.pdf?src-supplier=Texas+Instruments; ComponentLink3URL: https://datasheet.octopart.com:443/INA240A1PWR-Texas-Instruments-datasheet-100480378.pdf?src-supplier=Newark; ComponentLink3Description: https://datasheet.octopart.com:443/INA240A1PWR-Texas-Instruments-datasheet-100480378.pdf?src-supplier=Newark; ComponentLink4URL: https://datasheet.octopart.com:443/INA240A1PWR-Texas-Instruments-datasheet-68439366.pdf?src-supplier=element14+APAC; ComponentLink4Description: https://datasheet.octopart.com:443/INA240A1PWR-Texas-Instruments-datasheet-68439366.pdf?src-supplier=element14+APAC; ComponentLink5URL: https://datasheet.octopart.com:443/INA240A1PWR-Texas-Instruments-datasheet-165803933.pdf?src-supplier=LCSC; ComponentLink5Description: https://datasheet.octopart.com:443/INA240A1PWR-Texas-Instruments-datasheet-165803933.pdf?src-supplier=LCSC; ComponentLink6URL: https://datasheet.octopart.com:443/INA240A1PWR-Texas-Instruments-datasheet-160706886.pdf?src-supplier=LCSC; ComponentLink6Description: https://datasheet.octopart.com:443/INA240A1PWR-Texas-Instruments-datasheet-160706886.pdf?src-supplier=LCSC; ComponentLink7URL: https://datasheet.octopart.com:443/INA240A1PWR-Texas-Instruments-datasheet-147851276.pdf?src-supplier=SHENGYU+ELECTRONICS; ComponentLink7Description: https://datasheet.octopart.com:443/INA240A1PWR-Texas-Instruments-datasheet-147851276.pdf?src-supplier=SHENGYU+ELECTRONICS; ComponentLink8URL: https://datasheet.octopart.com:443/INA240A1PWR-Texas-Instruments-datasheet-140571434.pdf?src-supplier=Arrow.cn; ComponentLink8Description: https://datasheet.octopart.com:443/INA240A1PWR-Texas-Instruments-datasheet-140571434.pdf?src-supplier=Arrow.cn; ComponentLink9URL: http://sigma.octopart.com:80/reach_statement/Texas-Instruments-company-64.pdf?src-supplier=Compliance+Statements; ComponentLink9Description: http://sigma.octopart.com:80/reach_statement/Texas-Instruments-company-64.pdf?src-supplier=Compliance+Statements; ComponentLink10URL: http://sigma.octopart.com:80/conflict_mineral_statement/Texas-Instruments-company-63.pdf?src-supplier=Compliance+Statements; ComponentLink10Description: http://sigma.octopart.com:80/conflict_mineral_statement/Texas-Instruments-company-63.pdf?src-supplier=Compliance+Statements